# Altium project Brake By Wire.PrjPcb
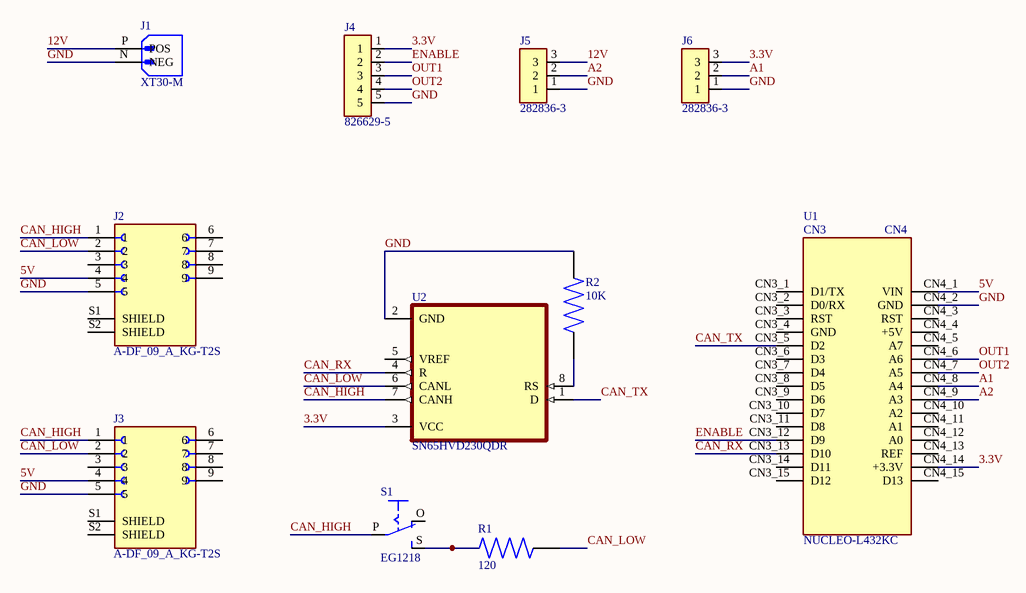
[diagram p0: Sheet1.SchDoc]
1 sheet, 11 parts. Net scope: global (net labels, ports and power ports of the same name join across sheets).
Board file: Brake By Wire.PcbDoc

## Sheet Sheet1.SchDoc
size A; SheetNumber: 1; SheetTotal: 1

### Parts
J1  XT30-M  [AMASS_XT60-M]
J2  A-DF_09_A_KG-T2S  [ASSMANN_A-DF_09_A_KG-T2S]
J3  A-DF_09_A_KG-T2S  [ASSMANN_A-DF_09_A_KG-T2S]
J4  826629-5  [TE_826629-5]
J5  282836-3  [TE_282836-3]
J6  282836-3  [TE_282836-3]
R1  120  [RESC3216X65N]
R2  10K  [RESC3216X65N]
S1  EG1218  [EG1218]
U1  NUCLEO-L432KC  [MODULE_NUCLEO-L432KC]
U2  SN65HVD230QDR  [SOIC127P599X175-8N]

### Nets
3.3V: J4.1 J6.3 U1.CN4_14(+3.3V) U2.3(VCC)
5V: J2.4 J3.4 U1.CN4_1(VIN)
12V: J1.P(POS) J5.3
A1: J6.2 U1.CN4_8(A4)
A2: J5.2 U1.CN4_9(A3)
CAN_HIGH: J2.1 J3.1 S1.P U2.7(CANH)
CAN_LOW: J2.2 J3.2 R1.2 U2.6(CANL)
CAN_RX: U1.CN3_13(D10) U2.4(R)
CAN_TX: U1.CN3_5(D2) U2.1(D)
ENABLE: J4.2 U1.CN3_12(D9)
GND: J1.N(NEG) J2.5 J3.5 J4.5 J5.1 J6.1 R2.2 U1.CN4_2(GND) U2.2(GND)
OUT1: J4.3 U1.CN4_6(A6)
OUT2: J4.4 U1.CN4_7(A5)
NetR1_1: R1.1 S1.S
NetR2_1: R2.1 U2.8(RS)

Not connected (* = marked no-connect by the designer): J2 3 6 7 8 9 S1(SHIELD) S2(SHIELD); J3 3 6 7 8 9 S1(SHIELD) S2(SHIELD); S1 O; U1 CN3_1(D1/TX) CN3_2(D0/RX) CN3_3(RST) CN3_4(GND) CN3_6(D3) CN3_7(D4) CN3_8(D5) CN3_9(D6) CN3_10(D7) CN3_11(D8) CN3_14(D11) CN3_15(D12) CN4_3(RST) CN4_4(+5V) CN4_5(A7) CN4_10(A2) CN4_11(A1) CN4_12(A0) CN4_13(REF) CN4_15(D13); U2 5(VREF)

### Notes on the sheet
- (in symbol NUCLEO-L432KC) CN3; CN4

### Library data of the parts
J1 = XT30-M: Plug; DC supply; XT60; male; PIN: 2; for cable; soldered; 30A; 500V; MP: XT60-M; MF: AMASS; Package: Package; Availability: Not in stock; SnapEDA_Link: https://www.snapeda.com/parts/XT60-M/AMASS/view-part/?ref=snap; Check_prices: https://www.snapeda.com/parts/XT60-M/AMASS/view-part/?ref=eda; Price: None; Value: *
J2 J3 = A-DF_09_A_KG-T2S: 9 Position D-Sub Receptacle, Female Sockets Connector; MF: Assmann WSW; MP: A-DF 09 A/KG-T2S; Value: *; Purchase-URL: https://pricing.snapeda.com/search/part/A-DF 09 A/KG-T2S/?ref=eda; Package: None; Check_prices: https://www.snapeda.com/parts/A-DF%2009%20A/KG-T2S/Assmann+WSW+Components/view-part/?ref=eda; Price: None; SnapEDA_Link: https://www.snapeda.com/parts/A-DF%2009%20A/KG-T2S/Assmann+WSW+Components/view-part/?ref=snap; Availability: In Stock
J4 = 826629-5: Board-To-Board Connector, AMPMODU MOD II Series, Through Hole, Header, 5, 2.54 mm; Number_of_Positions: 5; Centerline_Pitch: 2.54 mm[.1 in]; MF: TE Connectivity; Product_Type: Connector; Availability: Unavailable; EU_RoHS_Compliance: Compliant; Package: None; MP: 826629-5; TE_purchase_URL: https://www.te.com/usa-en/product-826629-5.html?te_bu=Cor&te_type=disp&te_campaign=seda_glo_cor-seda-global-disp-prtnr-fy19-seda-model-bom-cta_sma-317_1&elqCampaignId=32493; SnapEDA_Link: https://www.snapeda.com/parts/826629-5/TE%20Connectivity%20AMP%20Connectors/view-part/905319/?ref=snap; Price: None; Value: *
J5 J6 = 282836-3: TERM BLOCK 3POS SIDE ENTRY 5MM; Price: None; Value: *; Package: None; Availability: Unavailable; MP: 282836-3
R1 R2 = KTR18EZPF9530: Package: None; Price: None; Value: *; MP: KTR18EZPF9530; Availability: Unavailable
S1 = EG1218: <b>SLIDING SWITCH</b><p> 0.1" spacing through hole, vertical SPDT slide switch <p>http://www.ladyada.net/library/pcb/eaglelibrary.html</p>; Package: None; Availability: Unavailable; Value: *; MP: EG1218; Price: None
U1 = NUCLEO-L432KC: STM32 Nucleo-32 development board with STM32L432KC MCU, supports Arduino connectivity; Package: None; Price: None; Availability: Unavailable; MP: NUCLEO-L432KC; Value: *
U2 = SN65HVD230QDR: 3.3-V CAN Transceiver with Standby Mode 8-SOIC -40 to 125; MF: Texas Instruments; Package: SOIC-8 Texas Instruments; Price: None; MP: SN65HVD230QDR; Availability: Good; Value: *; Check_prices: https://www.snapeda.com/parts/SN65HVD230QDR/Texas%20Instruments/view-part/1178075/?ref=eda; Purchase-URL: https://pricing.snapeda.com/search/part/SN65HVD230QDR/?ref=eda; SnapEDA_Link: https://www.snapeda.com/parts/SN65HVD230QDR/Texas%20Instruments/view-part/1178075/?ref=snap